# EAGLE schematic Driver (EAGLE 9.6.2)
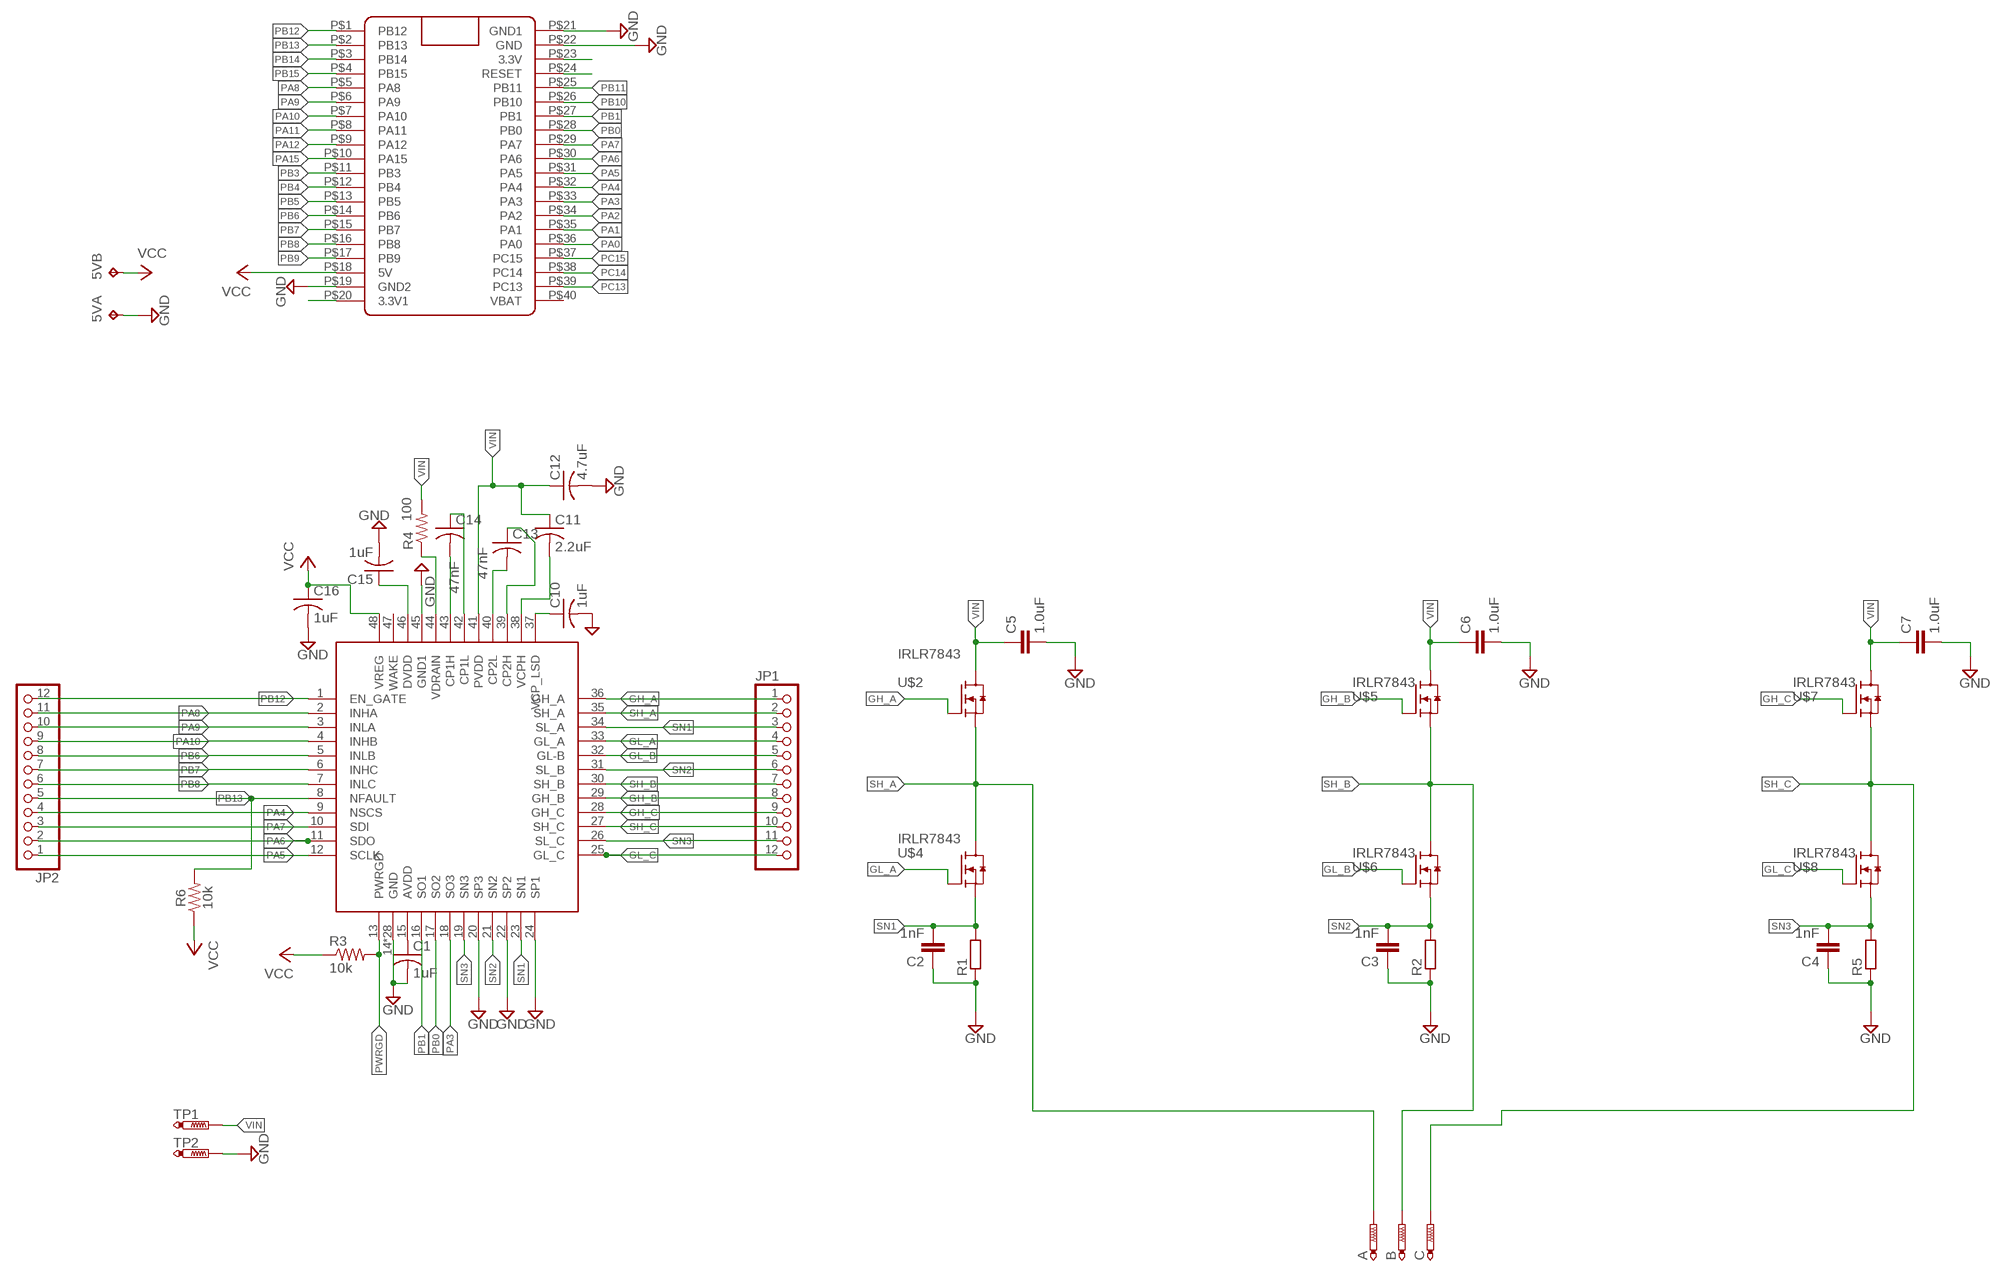
[diagram p0: schematic, sheet 1]

## Parts
5V  TP2P2-38-17  [P2-38-17]
A  PTR1PAD1-20Y  [P1-20Y]
B  PTR1PAD1-20Y  [P1-20Y]
C  PTR1PAD1-20Y  [P1-20Y]
C1  1uF  C-USC0603  [C0603]
C2  1nF  1.0NF/1000PF-0603-50V-10%  [0603]
C3  1nF  1.0NF/1000PF-0603-50V-10%  [0603]
C4  1nF  1.0NF/1000PF-0603-50V-10%  [0603]
C5  1.0uF  1.0UF-0603-16V-10%-X7R  [0603]
C6  1.0uF  1.0UF-0603-16V-10%-X7R  [0603]
C7  1.0uF  1.0UF-0603-16V-10%-X7R  [0603]
C10  1uF  C-USC0603  [C0603]
C11  2.2uF  C-USC0603  [C0603]
C12  4.7uF  C-USC0603  [C0603]
C13  47nF  C-USC0603  [C0603]
C14  47nF  C-USC0603  [C0603]
C15  1uF  C-USC0603  [C0603]
C16  1uF  C-USC0603  [C0603]
JP1  PINHD-1X12  [1X12]
JP2  PINHD-1X12  [1X12]
R1  R-EU_R2512  [R2512]
R2  R-EU_R2512  [R2512]
R3  10k  R-US_R0603  [R0603]
R4  100  R-US_R0603  [R0603]
R5  R-EU_R2512  [R2512]
R6  10k  10KOHM-0603-1/10W-1%  [0603]
TP1  PTR1PAD1-20Y  [P1-20Y]
TP2  PTR1PAD1-20Y  [P1-20Y]
U$1  BLUE_PILLADVANCED  [BLUE_PILL_ADV]
U$2  IRLR7843  [TO252]
U$3  DRV8305  [PFB_S-PQFP-G48]
U$4  IRLR7843  [TO252]
U$5  IRLR7843  [TO252]
U$6  IRLR7843  [TO252]
U$7  IRLR7843  [TO252]
U$8  IRLR7843  [TO252]

## Nets
CP1H: C14.2 U$3.43(CP1H)
CP1L: C14.1 U$3.42(CP1L)
CP2H: C13.1 U$3.39(CP2H)
CP2L: C13.2 U$3.40(CP2L)
DVDD: C15.1 U$3.46(DVDD)
GH_A: JP1.1 U$2.1(G) U$3.36(GH_A)
GH_B: JP1.8 U$3.29(GH_B) U$5.1(G)
GH_C: JP1.9 U$3.28(GH_C) U$7.1(G)
GL_A: JP1.4 U$3.33(GL_A) U$4.1(G)
GL_B: JP1.5 U$3.32(GL-B) U$6.1(G)
GL_C: JP1.12 U$3.25(GL_C) U$8.1(G)
GND: 5V.TP-1 C1.2 C2.1 C3.1 C4.1 C5.2 C6.2 C7.2 C10.2 C12.2 C15.2 C16.2 R1.1 R2.1 R5.1 TP2.TP U$1.P$19(GND2) U$1.P$21(GND1) U$1.P$22(GND) U$3.14(GND) U$3.20(SP3) U$3.22(SP2) U$3.24(SP1) U$3.45(GND1) U$3.P$1(GND) U$3.P$2(GND) U$3.P$3(GND) U$3.P$4(GND) U$3.P$5(GND) U$3.P$6(GND) U$3.P$7(GND) U$3.P$8(GND) U$3.P$9(GND) U$3.P$10(GND) U$3.P$11(GND) U$3.P$12(GND) U$3.P$13(GND) U$3.P$14(GND) U$3.P$15(GND) U$3.P$16(GND) U$3.P$17(GND) U$3.P$18(GND) U$3.P$19(GND) U$3.P$20(GND) U$3.P$21(GND) U$3.P$22(GND) U$3.P$23(GND) U$3.P$24(GND) U$3.P$25(GND) U$3.P$26(GND) U$3.P$27(GND)
N$3: U$1.P$23(3.3V)
N$4: U$1.P$24(RESET)
N$15: C1.1 U$3.15(AVDD)
N$40: U$1.P$20(3.3V1)
PA0: U$1.P$36(PA0)
PA1: U$1.P$35(PA1)
PA2: U$1.P$34(PA2)
PA3: U$1.P$33(PA3) U$3.18(SO3)
PA4: JP2.4 U$1.P$32(PA4) U$3.9(NSCS)
PA5: JP2.1 U$1.P$31(PA5) U$3.12(SCLK)
PA6: JP2.2 U$1.P$30(PA6) U$3.11(SDO)
PA7: JP2.3 U$1.P$29(PA7) U$3.10(SDI)
PA8: JP2.11 U$1.P$5(PA8) U$3.2(INHA)
PA9: JP2.10 U$1.P$6(PA9) U$3.3(INLA)
PA10: JP2.9 U$1.P$7(PA10) U$3.4(INHB)
PA11: U$1.P$8(PA11)
PA12: U$1.P$9(PA12)
PA15: U$1.P$10(PA15)
PB0: U$1.P$28(PB0) U$3.17(SO2)
PB1: U$1.P$27(PB1) U$3.16(SO1)
PB3: U$1.P$11(PB3)
PB4: U$1.P$12(PB4)
PB5: U$1.P$13(PB5)
PB6: JP2.8 U$1.P$14(PB6) U$3.5(INLB)
PB7: JP2.7 U$1.P$15(PB7) U$3.6(INHC)
PB8: JP2.6 U$1.P$16(PB8) U$3.7(INLC)
PB9: U$1.P$17(PB9)
PB10: U$1.P$26(PB10)
PB11: U$1.P$25(PB11)
PB12: JP2.12 U$1.P$1(PB12) U$3.1(EN_GATE)
PB13: JP2.5 R6.2 U$1.P$2(PB13) U$3.8(NFAULT)
PB14: U$1.P$3(PB14)
PB15: U$1.P$4(PB15)
PC13: U$1.P$39(PC13)
PC14: U$1.P$38(PC14)
PC15: U$1.P$37(PC15)
PWRGD: R3.2 U$3.13(PWRGD)
SH_A: A.TP JP1.2 U$2.2(S) U$3.35(SH_A) U$4.3(D)
SH_B: B.TP JP1.7 U$3.30(SH_B) U$5.2(S) U$6.3(D)
SH_C: C.TP JP1.10 U$3.27(SH_C) U$7.2(S) U$8.3(D)
SN1: C2.2 JP1.3 R1.2 U$3.23(SN1) U$3.34(SL_A) U$4.2(S)
SN2: C3.2 JP1.6 R2.2 U$3.21(SN2) U$3.31(SL_B) U$6.2(S)
SN3: C4.2 JP1.11 R5.2 U$3.19(SN3) U$3.26(SL_C) U$8.2(S)
VCC: 5V.TP-2 C16.1 R3.1 R6.1 U$1.P$18(5V) U$3.48(VREG)
VCP_LSD: C10.1 U$3.37(VCP_LSD)
VCPH: C11.2 U$3.38(VCPH)
VDRAIN: R4.1 U$3.44(VDRAIN)
VIN: C5.1 C6.1 C7.1 C11.1 C12.1 R4.2 TP1.TP U$2.3(D) U$3.41(PVDD) U$5.3(D) U$7.3(D)
Unconnected: U$1.P$40(VBAT) U$3.47(WAKE)

## Library data of the parts
5V = testpad:TP2: Test pad
A B C TP1 TP2 = testpad:PTR1: TEST PIN
C1 C10-C16 = rcl:C-US: CAPACITOR, American symbol; SPICEPREFIX: C
C2-C4 = SparkFun-Capacitors:1.0NF/1000PF: 1nF/1,000pF ceramic capacitors A capacitor is a passive two-terminal electrical component used to store electrical energy temporarily in an electric field.; PROD_ID: CAP-07886
C5-C7 = SparkFun-Capacitors:1.0UF: 1µF ceramic capacitors A capacitor is a passive two-terminal electrical component used to store electrical energy temporarily in an electric field.; PROD_ID: CAP-13930
JP1 JP2 = pinhead:PINHD-1X12: PIN HEADER
R1 R2 R5 = rcl:R-EU_: RESISTOR, European symbol; SPICEPREFIX: R
R3 R4 = rcl:R-US_: RESISTOR, American symbol; SPICEPREFIX: R
R6 = SparkFun-Resistors:10KOHM: 10kΩ resistor A resistor is a passive two-terminal electrical component that implements electrical resistance as a circuit element. Resistors act to reduce current flow, and, at the same time, act to lower voltage levels within circuits. - Wikipedia; PROD_ID: RES-00824
U$1 = BluePill:BLUE_PILL
U$2 U$4-U$8 = BLDC project:IRLR7843
U$3 = BLDC project:DRV8305